# Altium schematic sheet Carrier_Board.SchDoc
size B
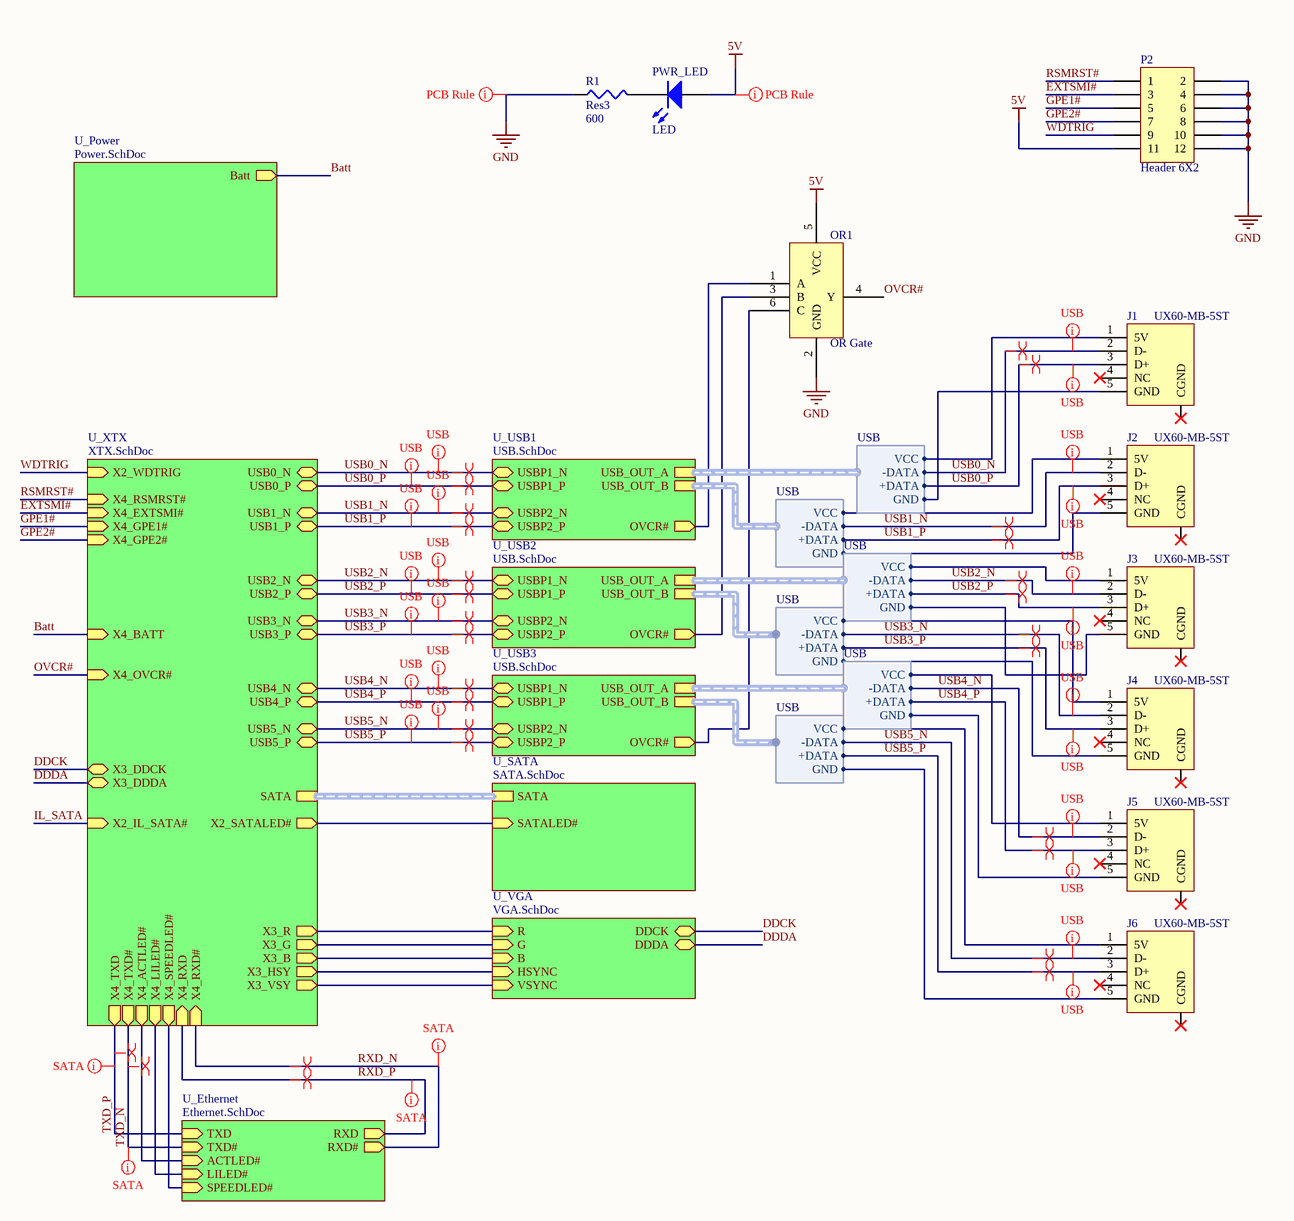
[diagram p0: Carrier_Board.SchDoc]

## Parts
J1  UX60-MB-5ST  [UX60-MB-5ST]
J2  UX60-MB-5ST  [UX60-MB-5ST]
J3  UX60-MB-5ST  [UX60-MB-5ST]
J4  UX60-MB-5ST  [UX60-MB-5ST]
J5  UX60-MB-5ST  [UX60-MB-5ST]
J6  UX60-MB-5ST  [UX60-MB-5ST]
OR1  OR Gate  [TSOP65P210X110-6N]
P2  Header 6X2  [HDR2X6]
PWR_LED  LED  [0805]
R1  Res3  value 600  [J1-0603]

## Sub-sheets
U_Ethernet = Ethernet.SchDoc: TXD (in), TXD# (in), RXD (out), RXD# (out), ACTLED# (in), LILED# (in), SPEEDLED# (in)
U_Power = Power.SchDoc: Batt (out)
U_SATA = SATA.SchDoc: SATA (harness SATA), SATALED# (in)
U_USB1 = USB.SchDoc: USB_OUT_A (harness USB), USB_OUT_B (harness USB), OVCR# (out), USBP1_N (bidir), USBP1_P (bidir), USBP2_N (bidir), USBP2_P (bidir)
U_USB2 = USB.SchDoc: USB_OUT_A (harness USB), USB_OUT_B (harness USB), OVCR# (out), USBP1_N (bidir), USBP1_P (bidir), USBP2_N (bidir), USBP2_P (bidir)
U_USB3 = USB.SchDoc: USB_OUT_A (harness USB), USB_OUT_B (harness USB), OVCR# (out), USBP1_N (bidir), USBP1_P (bidir), USBP2_N (bidir), USBP2_P (bidir)
U_VGA = VGA.SchDoc: R (in), G (in), B (in), HSYNC (in), VSYNC (in), DDCK (bidir), DDDA (bidir)
U_XTX = XTX.SchDoc: X4_OVCR# (in), SATA (harness SATA), X2_IL_SATA# (in), X2_SATALED# (out), X3_R (out), X3_HSY (out), X3_VSY (out), X3_DDCK (bidir), X3_DDDA (bidir), X4_BATT (in), X4_LILED# (out), X4_ACTLED# (out), X4_SPEEDLED# (out), X4_RXD# (in), X4_RXD (in), X4_TXD# (out), X4_TXD (out), X3_B (out), X3_G (out), X2_WDTRIG (in), X4_RSMRST# (in), X4_EXTSMI# (in), X4_GPE2# (in), X4_GPE1# (in), USB2_N (bidir), USB3_N (bidir), USB2_P (bidir), USB3_P (bidir), USB0_N (bidir), USB0_P (bidir), USB1_P (bidir), USB1_N (bidir), USB5_N (bidir), USB4_P (bidir), USB4_N (bidir), USB5_P (bidir)

## Harnesses
USB: VCC, -DATA, +DATA, GND

## Nets
5V: OR1.5(VCC) P2.11 PWR_LED.1(A)
GND: OR1.2(GND) P2.2 P2.4 P2.6 P2.8 P2.10 P2.12 R1.1
Batt: sheet U_XTX/X4_BATT, sheet U_Power/Batt
DDCK: sheet U_VGA/DDCK, sheet U_XTX/X3_DDCK
DDDA: sheet U_VGA/DDDA, sheet U_XTX/X3_DDDA
EXTSMI#: P2.3 ; sheet U_XTX/X4_EXTSMI#
GPE1#: P2.5 ; sheet U_XTX/X4_GPE1#
GPE2#: P2.7 ; sheet U_XTX/X4_GPE2#
IL_SATA: sheet U_XTX/X2_IL_SATA#
OVCR#: OR1.4(Y) ; sheet U_XTX/X4_OVCR#
RSMRST#: P2.1 ; sheet U_XTX/X4_RSMRST#
RXD_N: sheet U_Ethernet/RXD#, sheet U_XTX/X4_RXD#
RXD_P: sheet U_Ethernet/RXD, sheet U_XTX/X4_RXD
TXD_N: sheet U_Ethernet/TXD#, sheet U_XTX/X4_TXD#
TXD_P: sheet U_Ethernet/TXD, sheet U_XTX/X4_TXD
USB0_N: J1.2(D-) ; sheet U_USB1/USBP1_N, sheet U_XTX/USB0_N, sheet U_USB1/USB_OUT_A.-DATA
USB0_P: J1.3(D+) ; sheet U_USB1/USBP1_P, sheet U_XTX/USB0_P, sheet U_USB1/USB_OUT_A.+DATA
USB1_N: J2.2(D-) ; sheet U_USB1/USBP2_N, sheet U_XTX/USB1_N, sheet U_USB1/USB_OUT_B.-DATA
USB1_P: J2.3(D+) ; sheet U_USB1/USBP2_P, sheet U_XTX/USB1_P, sheet U_USB1/USB_OUT_B.+DATA
USB2_N: J3.2(D-) ; sheet U_USB2/USBP1_N, sheet U_XTX/USB2_N, sheet U_USB2/USB_OUT_A.-DATA
USB2_P: J3.3(D+) ; sheet U_USB2/USBP1_P, sheet U_XTX/USB2_P, sheet U_USB2/USB_OUT_A.+DATA
USB3_N: J4.2(D-) ; sheet U_USB2/USBP2_N, sheet U_XTX/USB3_N, sheet U_USB2/USB_OUT_B.-DATA
USB3_P: J4.3(D+) ; sheet U_USB2/USBP2_P, sheet U_XTX/USB3_P, sheet U_USB2/USB_OUT_B.+DATA
USB4_N: J5.2(D-) ; sheet U_USB3/USBP1_N, sheet U_XTX/USB4_N, sheet U_USB3/USB_OUT_A.-DATA
USB4_P: J5.3(D+) ; sheet U_USB3/USBP1_P, sheet U_XTX/USB4_P, sheet U_USB3/USB_OUT_A.+DATA
USB5_N: J6.2(D-) ; sheet U_USB3/USBP2_N, sheet U_XTX/USB5_N, sheet U_USB3/USB_OUT_B.-DATA
USB5_P: J6.3(D+) ; sheet U_USB3/USBP2_P, sheet U_XTX/USB5_P, sheet U_USB3/USB_OUT_B.+DATA
WDTRIG: P2.9 ; sheet U_XTX/X2_WDTRIG
NetJ1_1: J1.1(5V) ; sheet U_USB1/USB_OUT_A.VCC
NetJ1_5: J1.5(GND) ; sheet U_USB1/USB_OUT_A.GND
NetJ2_1: J2.1(5V) ; sheet U_USB1/USB_OUT_B.VCC
NetJ2_5: J2.5(GND) ; sheet U_USB1/USB_OUT_B.GND
NetJ3_1: J3.1(5V) ; sheet U_USB2/USB_OUT_A.VCC
NetJ3_5: J3.5(GND) ; sheet U_USB2/USB_OUT_A.GND
NetJ4_1: J4.1(5V) ; sheet U_USB2/USB_OUT_B.VCC
NetJ4_5: J4.5(GND) ; sheet U_USB2/USB_OUT_B.GND
NetJ5_1: J5.1(5V) ; sheet U_USB3/USB_OUT_A.VCC
NetJ5_5: J5.5(GND) ; sheet U_USB3/USB_OUT_A.GND
NetJ6_1: J6.1(5V) ; sheet U_USB3/USB_OUT_B.VCC
NetJ6_5: J6.5(GND) ; sheet U_USB3/USB_OUT_B.GND
NetOR1_1: OR1.1(A) ; sheet U_USB1/OVCR#
NetOR1_3: OR1.3(B) ; sheet U_USB2/OVCR#
NetOR1_6: OR1.6(C) ; sheet U_USB3/OVCR#
NetPWR_LED_2: PWR_LED.2(K) R1.2
(unnamed): sheet U_Ethernet/ACTLED#, sheet U_XTX/X4_ACTLED#
(unnamed): sheet U_Ethernet/LILED#, sheet U_XTX/X4_LILED#
(unnamed): sheet U_Ethernet/SPEEDLED#, sheet U_XTX/X4_SPEEDLED#
(unnamed): sheet U_SATA/SATALED#, sheet U_XTX/X2_SATALED#
(unnamed): sheet U_VGA/R, sheet U_XTX/X3_R
(unnamed): sheet U_VGA/G, sheet U_XTX/X3_G
(unnamed): sheet U_VGA/B, sheet U_XTX/X3_B
(unnamed): sheet U_VGA/HSYNC, sheet U_XTX/X3_HSY
(unnamed): sheet U_VGA/VSYNC, sheet U_XTX/X3_VSY

Not connected (* = marked no-connect by the designer): J1 4(NC)* CGND*; J2 4(NC)* CGND*; J3 4(NC)* CGND*; J4 4(NC)* CGND*; J5 4(NC)* CGND*; J6 4(NC)* CGND*

## Buses and harness runs
harness sheet U_SATA/SATA = sheet U_XTX/SATA

## Layout directives
differential pair: RXD_N, RXD_P, TXD_N, TXD_P, USB0_N, USB0_P, USB1_N, USB1_P, USB2_N, USB2_P, USB3_N, USB3_P, USB4_N, USB4_P, USB5_N, USB5_P
rule Length Constraint [Min Length = 0mil    Max Length = 15000mil]; rule Impedance Constraint [Min = 0.000    Max = 105.0    ]; rule Width Constraint [Pref Width = 7mil    Min Width = 7mil    Max Width = 7mil]; rule Differential Pairs Routing [Pref Gap = 5mil    Min Gap  = 5mil    Max Gap  = 10mil]; rule Maximum Via Count Constraint [Max Count = 4]: USB0_N, USB0_P, USB1_N, USB1_P, USB2_N, USB2_P, USB3_N, USB3_P, USB4_N, USB4_P, USB5_N, USB5_P
rule Length Constraint [Min Length = 0mil    Max Length = 4000mil]; rule Width Constraint [Pref Width = 5mil    Min Width = 5mil    Max Width = 6mil]; rule Differential Pairs Routing [Pref Gap = 4mil    Min Gap  = 4mil    Max Gap  = 7mil]; rule Maximum Via Count Constraint [Max Count = 4]; rule Matched Net Lengths [Tolerance = 5mil]: RXD_N, RXD_P, TXD_N, TXD_P
rule Width Constraint [Pref Width = 10mil    Min Width = 7mil    Max Width = 100mil]: 5V, GND

## Library data of the parts
J1-J6 = UX60-MB-5ST: miniUSB Type B SMT Connector; Supplier Part #: H2959CT-ND; Supplier: Digi-Key
OR1 = OR Gate: 3 Input OR Gate; Supplier: DigiKey; Supplier Part #: 296-15943-1-ND
P2 = Header 6X2: Header, 6-Pin, Dual row; LatestRevisionDate: 17-Jul-2002; LatestRevisionNote: Re-released for DXP Platform.; Publisher: Altium Limited; Supplier: DigiKey; Supplier Part #: WM8124-ND
PWR_LED = LED1: Typical RED GaAs LED; Published: 8-Jun-2000; LatestRevisionDate: 08-Jul-2005; LatestRevisionNote: Mech Layer 1 removed.; PackageReference: LED-1; Publisher: Altium Limited; Supplier Part #: 475-2483-6-ND; Supplier: DigiKey
R1 = Res3: Resistor; Published: 8-Jun-2000; LatestRevisionDate: 04-Mar-2005; LatestRevisionNote: PCB Footprint replaced.; PackageReference: J1-0603; Publisher: Altium Limited; Supplier Part #: P604HCT-ND; Supplier: DigiKey